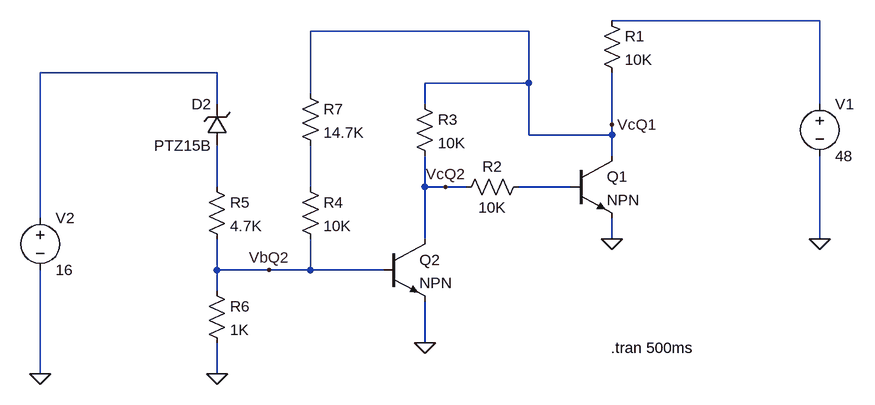
[diagram p0: schematic over-voltage-protect.asc]
over-voltage-protect.asc, the LTspice schematic file:
Version 4
SHEET 1 880 680
WIRE 560 -48 240 -48
WIRE 112 -32 -224 -32
WIRE -368 32 -640 32
WIRE 112 48 112 -32
WIRE 112 48 -48 48
WIRE -224 64 -224 -32
WIRE -368 80 -368 32
WIRE -48 80 -48 48
WIRE 560 80 560 -48
WIRE 240 112 240 32
WIRE 112 128 112 48
WIRE 240 128 240 112
WIRE 240 128 112 128
WIRE 240 160 240 128
WIRE -368 208 -368 144
WIRE -224 208 -224 144
WIRE -48 208 -48 160
WIRE -16 208 -48 208
WIRE 16 208 -16 208
WIRE 176 208 96 208
WIRE -640 256 -640 32
WIRE -48 288 -48 208
WIRE 240 288 240 256
WIRE 560 288 560 160
WIRE -368 336 -368 288
WIRE -288 336 -368 336
WIRE -224 336 -224 288
WIRE -224 336 -288 336
WIRE -112 336 -224 336
WIRE -368 368 -368 336
WIRE -48 448 -48 384
WIRE -640 496 -640 336
WIRE -368 496 -368 448
FLAG 240 288 0
FLAG 560 288 0
FLAG -48 448 0
FLAG -368 496 0
FLAG -640 496 0
FLAG -288 336 VbQ2
FLAG -16 208 VcQ2
FLAG 240 112 VcQ1
SYMBOL npn 176 160 R0
SYMATTR InstName Q1
SYMBOL res 224 -64 R0
SYMATTR InstName R1
SYMATTR Value 10K
SYMBOL voltage 560 64 R0
WINDOW 123 0 0 Left 0
WINDOW 39 0 0 Left 0
SYMATTR InstName V1
SYMATTR Value 48
SYMBOL res 112 192 R90
WINDOW 0 0 56 VBottom 2
WINDOW 3 32 56 VTop 2
SYMATTR InstName R2
SYMATTR Value 10K
SYMBOL res -64 64 R0
SYMATTR InstName R3
SYMATTR Value 10K
SYMBOL npn -112 288 R0
SYMATTR InstName Q2
SYMBOL res -240 192 R0
SYMATTR InstName R4
SYMATTR Value 10K
SYMBOL res -384 192 R0
SYMATTR InstName R5
SYMATTR Value 4.7K
SYMBOL res -384 352 R0
SYMATTR InstName R6
SYMATTR Value 1K
SYMBOL zener -352 144 R180
WINDOW 0 24 64 Left 2
WINDOW 3 24 0 Left 2
SYMATTR InstName D2
SYMATTR Value PTZ15B
SYMBOL voltage -640 240 R0
WINDOW 123 0 0 Left 0
WINDOW 39 0 0 Left 0
SYMATTR InstName V2
SYMATTR Value 16
SYMBOL res -240 48 R0
SYMATTR InstName R7
SYMATTR Value 14.7K
TEXT 238 456 Left 2 !.tran 500ms

The netlist it stands for:
* over-voltage-protect.asc
Q1 VcQ1 N005 0 0 NPN
R1 N001 VcQ1 10K
V1 N001 0 48
R2 N005 VcQ2 10K
R3 VcQ1 VcQ2 10K
Q2 VcQ2 VbQ2 0 0 NPN
R4 N004 VbQ2 10K
R5 N003 VbQ2 4.7K
R6 VbQ2 0 1K
D2 N003 N002 PTZ15B
V2 N002 0 16
R7 VcQ1 N004 14.7K
.model D D
.lib standard.dio
.model NPN NPN
.model PNP PNP
.lib standard.bjt
.tran 500ms
.backanno
.end